# EAGLE design TinyBattery(I2C_V1) (EAGLE 6.5.0)
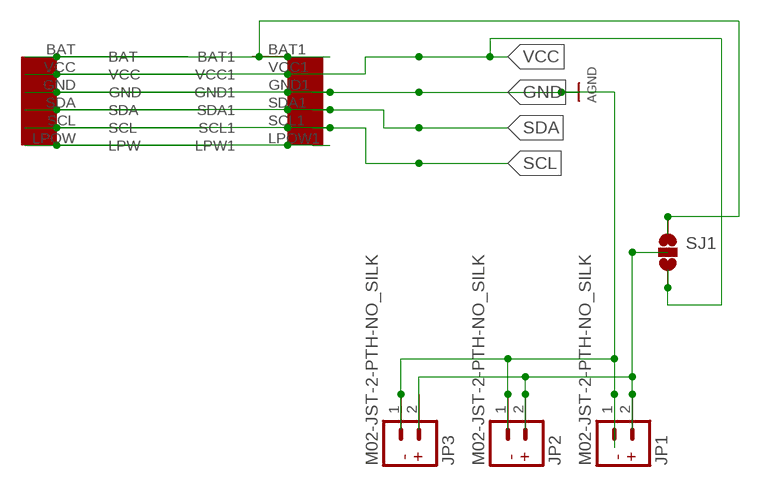
[diagram p0: schematic, sheet 1]

## Parts
JP1  M02-JST-2-PTH-NO_SILK  [JST-2-PTH-NS]
JP2  M02-JST-2-PTH-NO_SILK  [JST-2-PTH-NS]
JP3  M02-JST-2-PTH-NO_SILK  [JST-2-PTH-NS]
SJ1  SOLDERJUMPER_2WAYPASTE1&2  [SJ_3_PASTE1&2]
U$1  EZ-I2CHEADERV1  [EZ-I2CHEADERV1]

## Nets
BAT: SJ1.1 U$1.BAT U$1.BAT1
GND: JP1.1 JP2.1 JP3.1 U$1.GND U$1.GND1 ; supply symbol labelled AGND
N$1: JP1.2 JP2.2 JP3.2 SJ1.2
N$3: U$1.LPOW1(LPW1) U$1.LPOW(LPW)
SCL: U$1.SCL U$1.SCL1
SDA: U$1.SDA U$1.SDA1
VCC: SJ1.3 U$1.VCC U$1.VCC1

## Library data of the parts
JP1-JP3 = SparkFun-Connectors:M02: Standard 2-pin 0.1" header. Use with - straight break away headers ( PRT-00116) - right angle break away headers (PRT-00553) - swiss pins (PRT-00743) - machine pins (PRT-00117) - female headers (PRT-00115) Molex polarized connector foot print use with: PRT-08233 with associated crimp pins and housings. 2.54_SCREWTERM for use with PRT-10571. 3.5mm Screw Terminal footprints for PRT-08084 5mm Screw Terminal footprints for use with PRT-08433
SJ1 = SparkFun-Passives:SOLDERJUMPER_2WAY: Solder Jumper 2 way solder jumper
U$1 = UniqueInteractionsLib:EZ-I2CHEADERV1

## Board
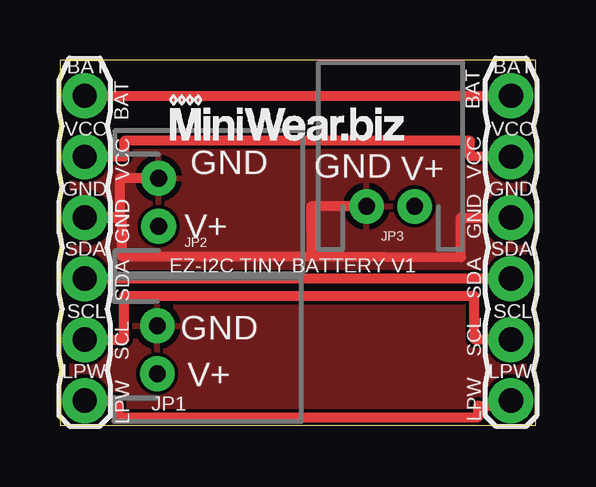
[diagram p1: board, top side]
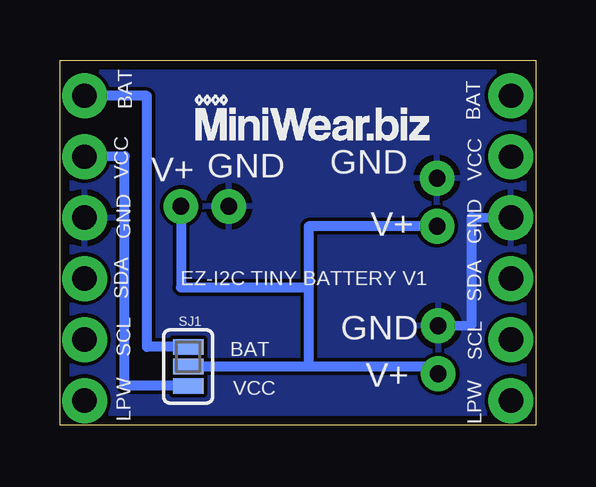
[diagram p2: board, bottom side, seen from below]

Size 19.83 x 15.21 mm. Coordinates in mm from the lower left corner, seen from the top.
Outline: 0,0 19.83,0 19.83,15.21 0,15.19 0,0
Copper layers (1*16): Top 0.0356mm / dielectric 1.5011mm / Bottom 0.0356mm
Design rules "oshParkPCBDesignRules": minimum track width 6mil, minimum drill 13mil, track to track 6mil, track to pad 6mil, pad to pad 6mil, via to via 6mil, smd to smd 6mil, copper to edge 15mil, drill to drill 6mil, minimum pad ring 7mil, minimum via ring 7mil, stop-mask expansion 3mil, vias tented up to drill 0mil, thermal gap 10mil

### Footprints (pad centres in the part's own frame; a part is rotated, then mirrored left to right if it is on the bottom)
JST-2-PTH-NS = drill 0.7 pad 1.448: 1 -1,0; 2 1,0
SJ_3_PASTE1&2 = smd 0.635 x 1.27: 1 -0.813,0; 2 0,0; 3 0.813,0
EZ-I2CHEADERV1 = drill 1.016 pad 1.88: BAT 0,-1.27; BAT1 17.78,-1.27; GND 0,-6.35; GND1 17.78,-6.35; LPOW 0,-13.97; LPOW1 17.78,-13.97; SCL 0,-11.43; SCL1 17.78,-11.43; SDA 0,-8.89; SDA1 17.78,-8.89; VCC 0,-3.81; VCC1 17.78,-3.81

### Placement (x,y rotation side)
JP1  4.06,3.14 270 top
JP2  4.11,9.28 270 top
JP3  13.79,9.11 0 top
SJ1  14.49,2.44 270 bottom
U$1  1.03,14.99 0 top
U$2  [LOGO2]  14.29,11.68 0 bottom
U$6  [LOGO2]  4.48,11.68 0 top

### Tracks (layer width: path | path; a pad name or v marks a point on that pad's centre or on a via)
BAT
  Top 0.406: U$1.BAT U$1.BAT1
  Bottom 0.406: SJ1.1 16.21,3.25 16.21,13.72 U$1.BAT1
GND
  Top 0.406: 10.49,7.03 10.47,7.04 2.58,7.04 2.58,8.64 U$1.GND 1.03,8.66 2.49,8.66 2.49,10.28 JP2.1 | 10.49,7.03 16.72,7 16.72,8.64 U$1.GND1 | JP3.1 10.47,9.11 10.49,7.03
  Bottom 0.406: JP1.1 2.66,4.16 2.66,8.66 U$1.GND
  pour Top: -1.94,17.15 20.85,17.22 20.76,-1.2 -2.1,-1.04
  pour Bottom: -3.09,-1.08 22.72,-0.76 22.82,17.13 -2.85,17.14
N$1
  Bottom 0.406: SJ1.2 9.47,2.44 | 9.47,2.44 4.06,2.44 JP1.2 | JP2.2 9.47,8.28 9.47,5.74 | 9.47,5.74 9.47,2.44 | JP3.2 14.79,5.74 9.47,5.74
N$3
  Top 0.406: U$1.LPOW 2.41,1.02 2.41,0.33 17.44,0.33 17.44,0.81 18.81,0.81 U$1.LPOW1
SCL
  Top 0.406: U$1.SCL 2.68,3.56 2.68,5.39 17.27,5.39 17.27,3.58 18.81,3.58 U$1.SCL1
SDA
  Top 0.406: U$1.SDA1 U$1.SDA
VCC
  Top 0.406: U$1.VCC1 17.1,11.19 17.1,11.84 2.68,11.84 2.68,11.18 U$1.VCC
  Bottom 0.406: SJ1.3 17.13,1.65 17.13,11.2 U$1.VCC1

### Text on the board
tNames: GND | GND | V+ | V+ | EZ-I2C TINY BATTERY V1 | GND | V+
bNames: GND | GND | V+ | V+ | EZ-I2C TINY BATTERY V1 | GND | BAT | V+ | VCC